# EAGLE design piHat_v1 (EAGLE 9.5.2)
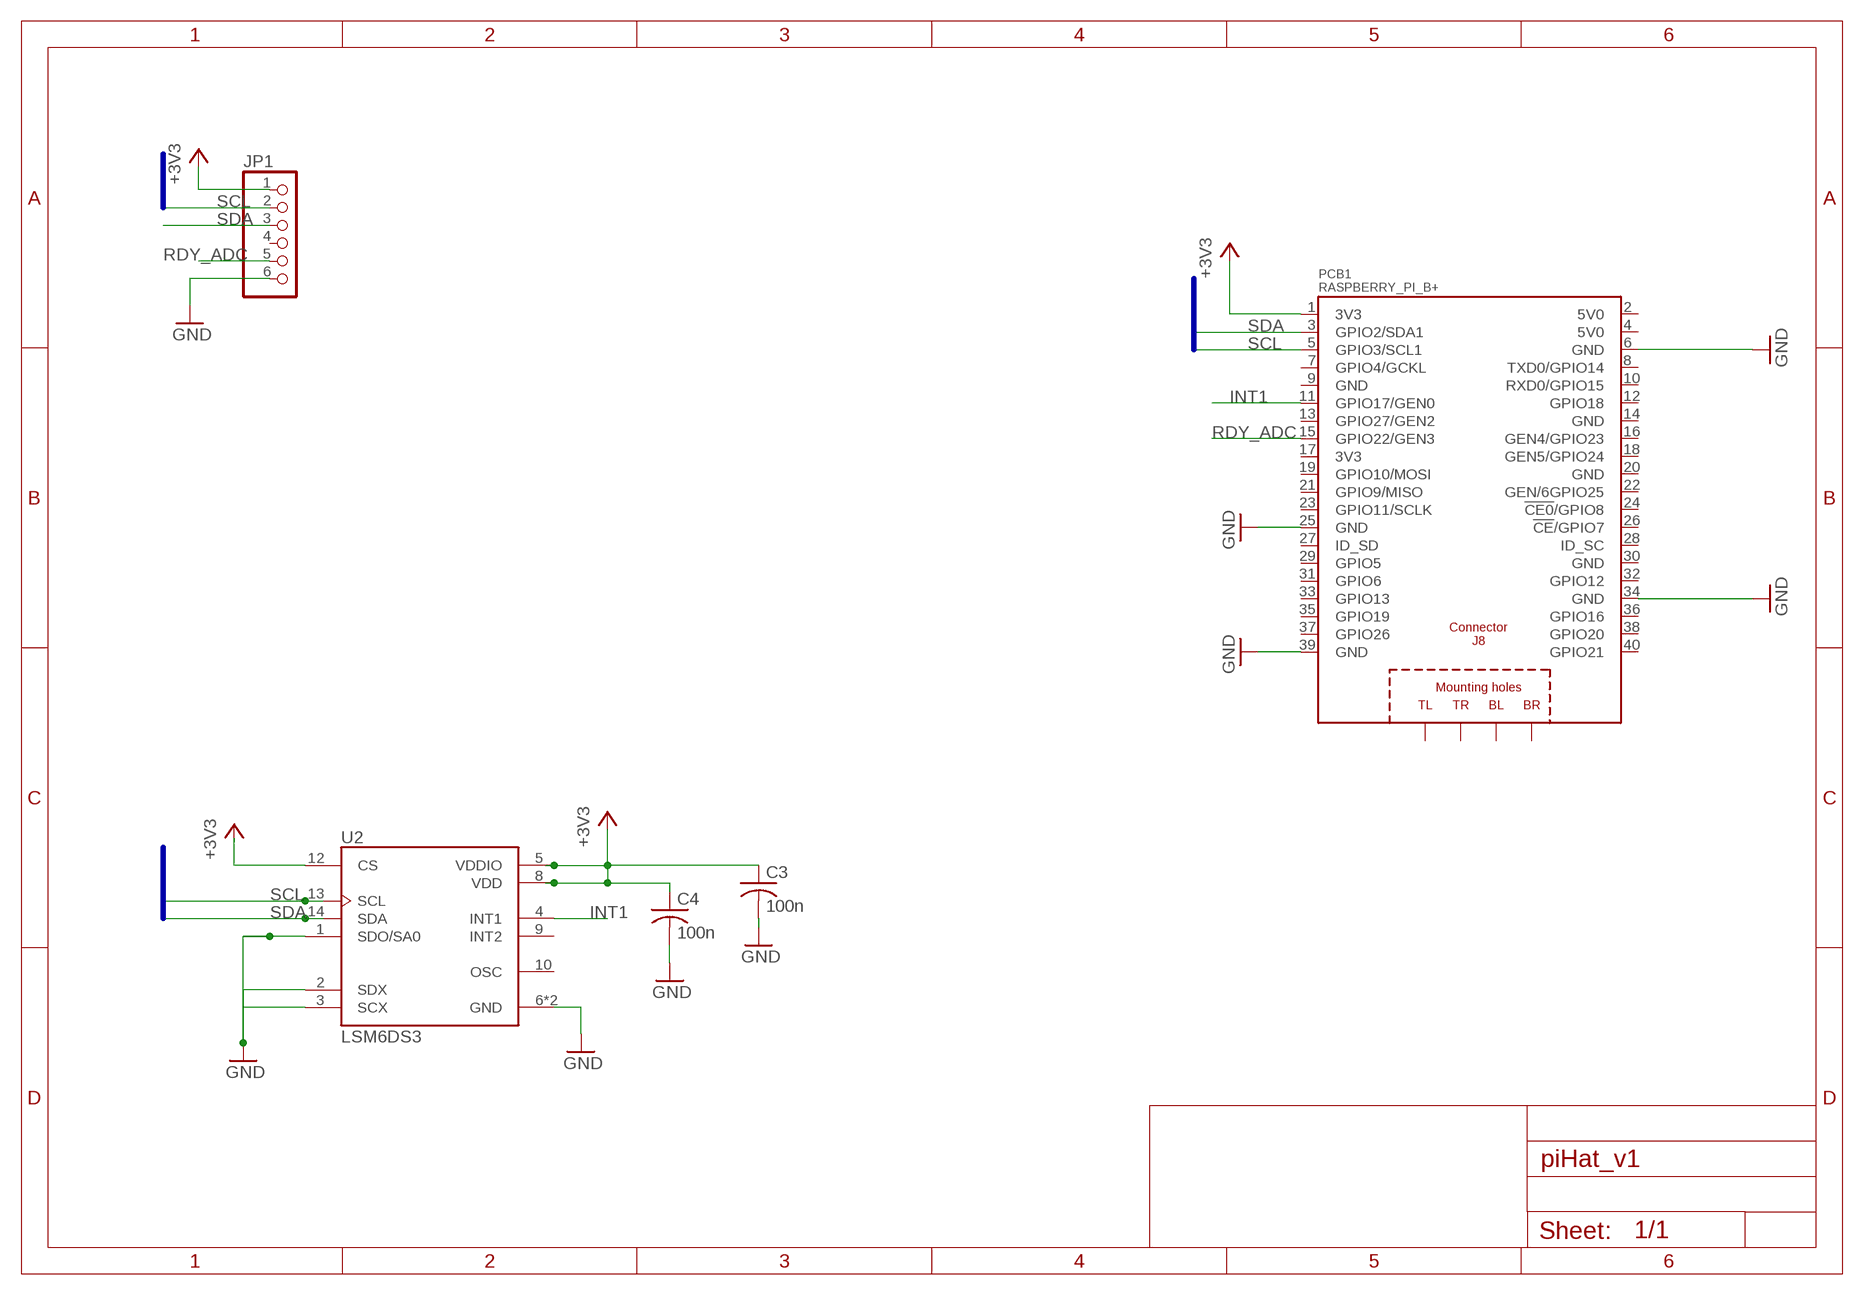
[diagram p0: schematic, sheet 1]

## Parts
C3  100n  C-USC1206  [C1206]
C4  100n  C-USC1206  [C1206]
JP1  PINHD-1X6  [1X06]
PCB1  RASPBERRY_PI_B+  [RASPBERRY_PI_B+]
U2  LSM6DS3  [PQFN50P300X250X86-14N]

## Nets
+3V3: C3.1 C4.1 JP1.1 PCB1.1(3V3) U2.5(VDDIO) U2.8(VDD) U2.12(CS)
GND: C3.2 C4.2 JP1.6 PCB1.6(GND) PCB1.25(GND) PCB1.39(GND) U2.1(SDO/SA0) U2.2(SDX) U2.3(SCX) U2.6(GND) U2.7(GND)
GND@7: PCB1.34(GND) ; supply symbol labelled GND
INT1: PCB1.11(GPIO17/GEN0) U2.4(INT1)
RDY_ADC: JP1.5 PCB1.15(GPIO22/GEN3)
SCL: JP1.2 PCB1.5(GPIO3/SCL1) U2.13(SCL)
SDA: JP1.3 PCB1.3(GPIO2/SDA1) U2.14(SDA)
Unconnected: JP1.4 PCB1.2(5V0) PCB1.4(5V0) PCB1.7(GPIO4/GCKL) PCB1.8(TXD0/GPIO14) PCB1.9(GND) PCB1.10(RXD0/GPIO15) PCB1.12(GPIO18) PCB1.13(GPIO27/GEN2) PCB1.14(GND) PCB1.16(GEN4/GPIO23) PCB1.17(3V3) PCB1.18(GEN5/GPIO24) PCB1.19(GPIO10/MOSI) PCB1.20(GND) PCB1.21(GPIO9/MISO) PCB1.22(GEN/6GPIO25) PCB1.23(GPIO11/SCLK) PCB1.24(!CE0!/GPIO8) PCB1.26(!CE!/GPIO7) PCB1.27(ID_SD) PCB1.28(ID_SC) PCB1.29(GPIO5) PCB1.30(GND) PCB1.31(GPIO6) PCB1.32(GPIO12) PCB1.33(GPIO13) PCB1.35(GPIO19) PCB1.36(GPIO16) PCB1.37(GPIO26) PCB1.38(GPIO20) PCB1.40(GPIO21) PCB1.PE_BL(BL) PCB1.PE_BR(BR) PCB1.PE_TL(TL) PCB1.PE_TR(TR) U2.9(INT2) U2.10(OSC)

## Buses
SCL,SDA
I2C:SCL,SDA

## Library data of the parts
C3 C4 = rcl:C-US: CAPACITOR, American symbol; SPICEPREFIX: C
JP1 = pinhead:PINHD-1X6: PIN HEADER
PCB1 = RASPBERRY_PI_B_:RASPBERRY_PI_B+: Raspberry Pi B+ Based on issue: Thursday, July 10, 2014 - Rev 1.2 LBR by Tim R. 07-2014; AVAILABILITY: Unavailable; DESCRIPTION: Case Plastic, ABS Black Hand Held, Split Sides 3.520 L x 2.740 W _89.41mm x 69.60mm_ X 0.980 _24.89mm_; MF: Raspberry Pi; MP: RASPBERRY PI B+; PACKAGE: None; PRICE: None
U2 = LSM6DS3:LSM6DS3: iNEMO inertial module: 3D accelerometer and 3D gyroscope; AVAILABILITY: Unavailable; DESCRIPTION: LSM6DS33 - Accelerometer, Gyroscope, 6 Axis Sensor Evaluation Board; MF: STMicroelectronics; MP: LSM6DS3; PACKAGE: LGA-14 STMicroelectronics; PRICE: None

## Board
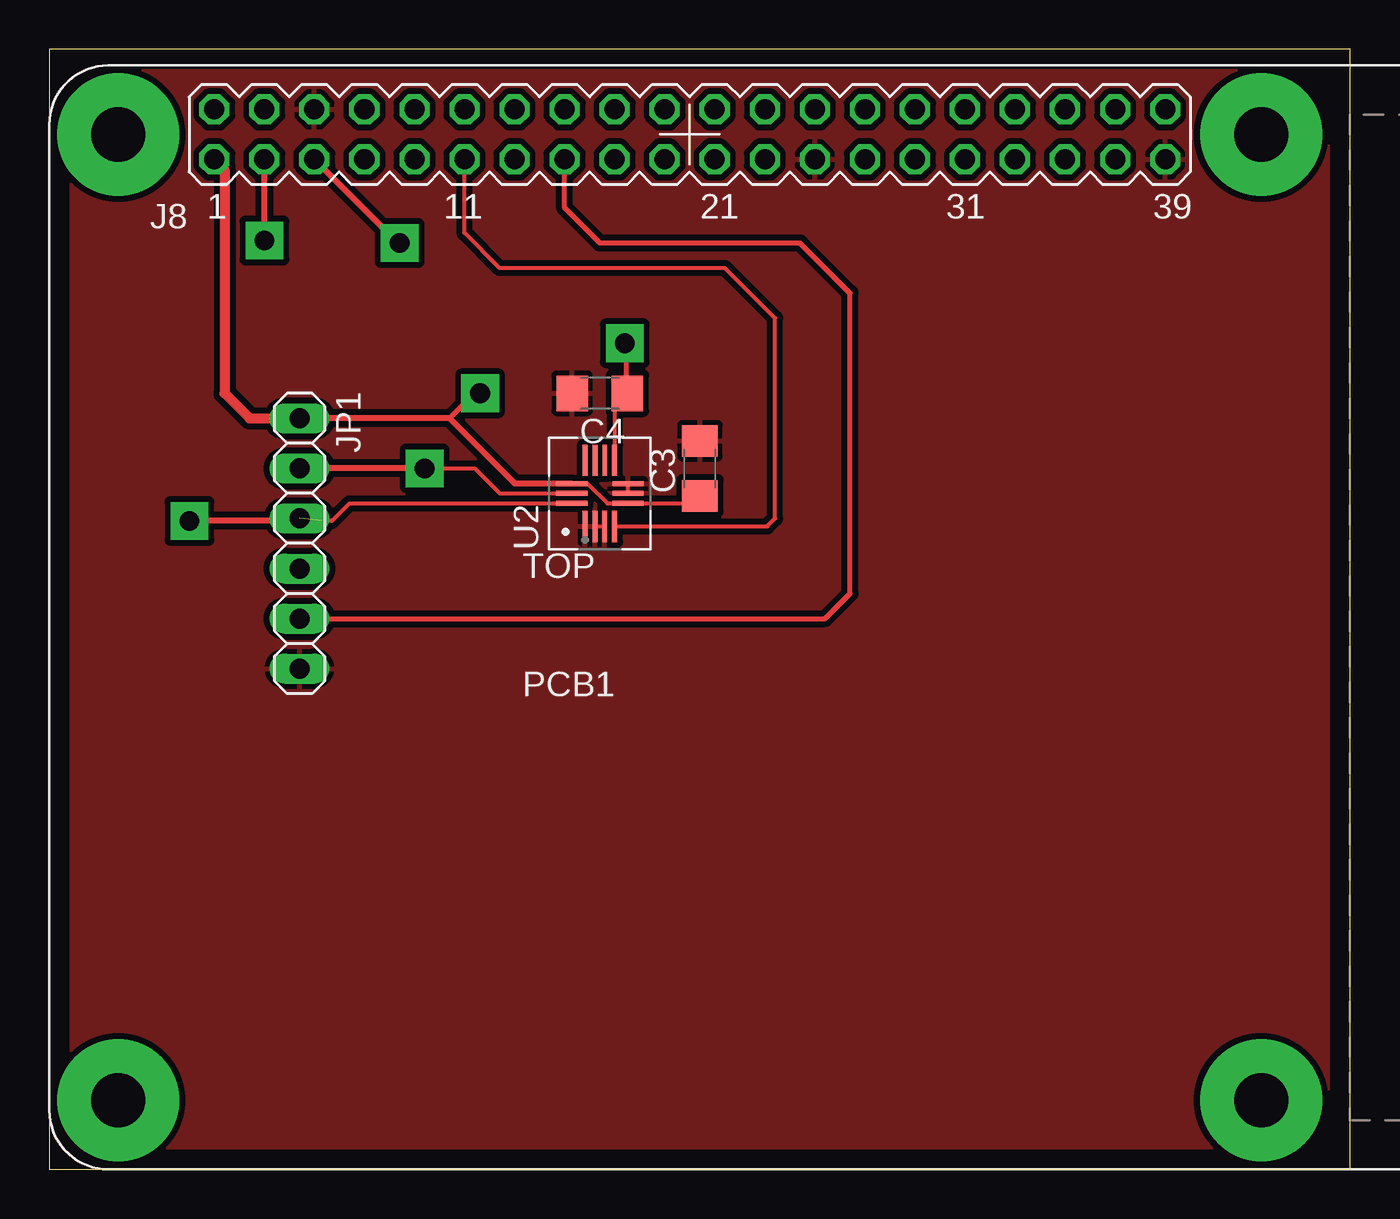
[diagram p1: board, top side]
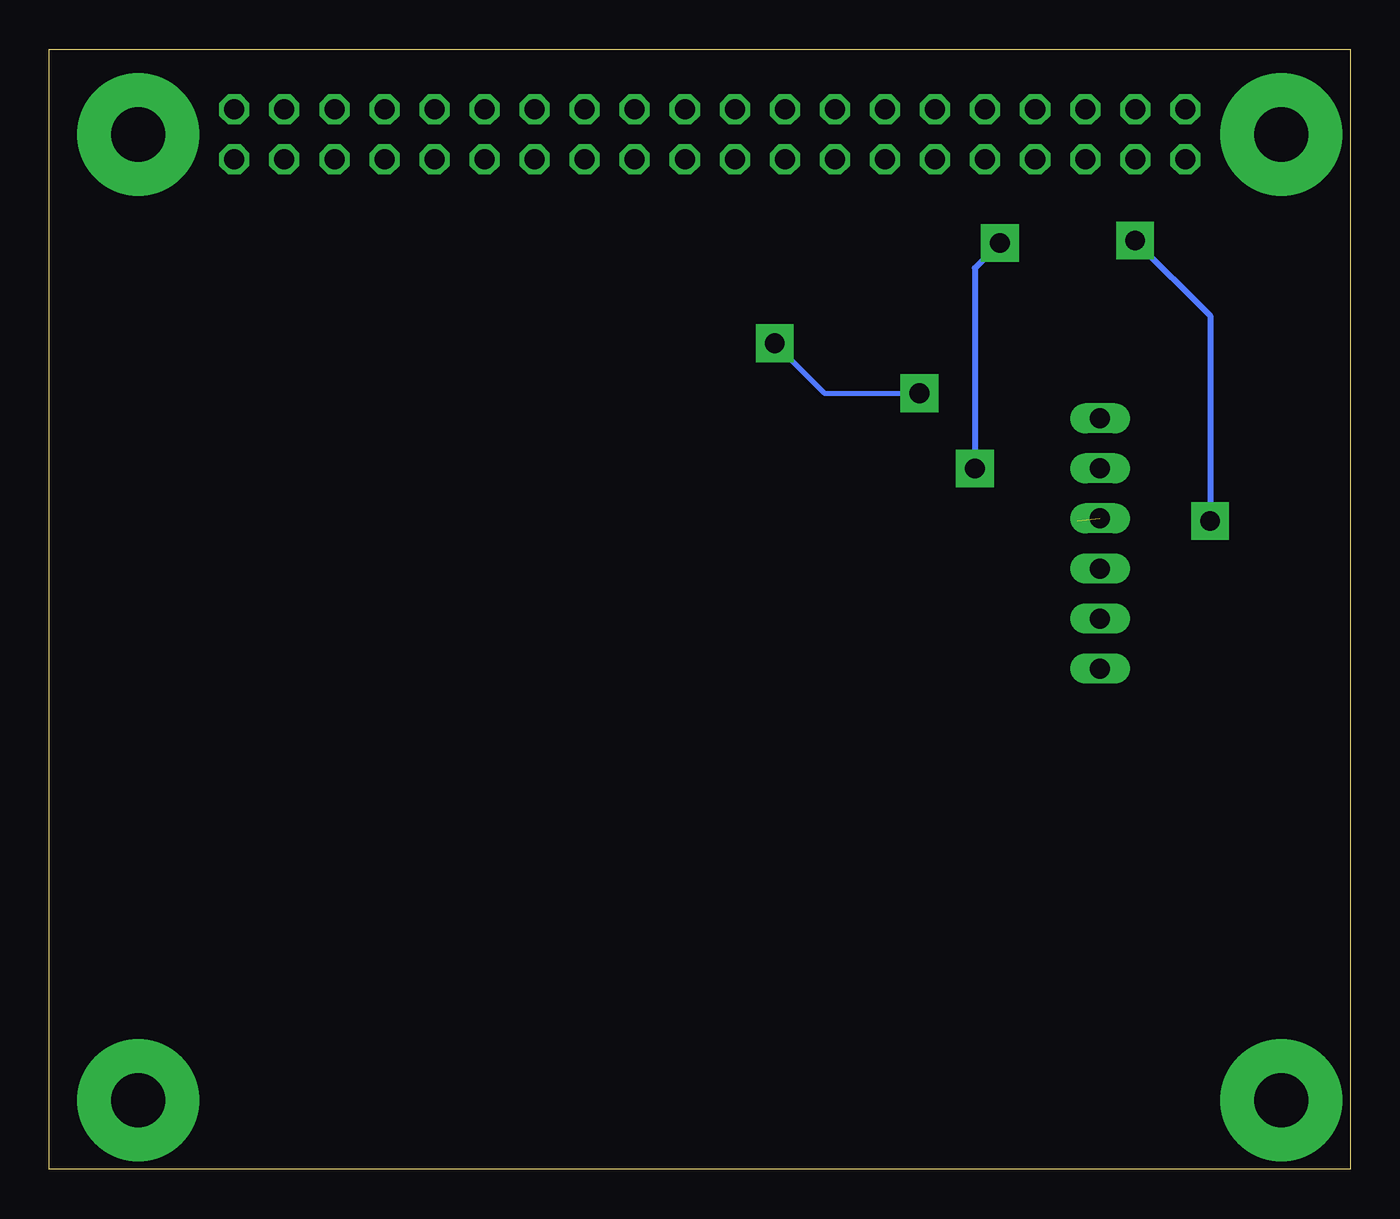
[diagram p2: board, bottom side, seen from below]

Size 66.02 x 56.82 mm. Coordinates in mm from the lower left corner, seen from the top.
Outline: 0,0 66.02,0 66.02,56.82 0,56.82 0,0
Copper layers (1*16): Top 0.035mm / dielectric 1.5mm / Bottom 0.035mm
Design rules "default *": minimum track width 6mil, minimum drill 0.35mm, track to track 12mil, track to pad 15mil, pad to pad 12mil, via to via 6mil, smd to smd 6mil, copper to edge 40mil, drill to drill 40mil, minimum pad ring 10mil, minimum via ring 18mil, stop-mask expansion 4mil, vias tented up to drill 0mil, thermal gap 10mil

### Footprints (pad centres in the part's own frame; a part is rotated, then mirrored left to right if it is on the bottom)
C1206 = smd 1.6 x 1.8: 1 -1.4,0; 2 1.4,0
1X06 = drill 1.016 long: 1 -6.35,0; 2 -3.81,0; 3 -1.27,0; 4 1.27,0; 5 3.81,0; 6 6.35,0
RASPBERRY_PI_B+ = drill 1.016 octagon: 1 8.37,51.23; 2 8.37,53.77; 3 10.91,51.23; 4 10.91,53.77; 5 13.45,51.23; 6 13.45,53.77; 7 15.99,51.23; 8 15.99,53.77; 9 18.53,51.23; 10 18.53,53.77; 11 21.07,51.23; 12 21.07,53.77; 13 23.61,51.23; 14 23.61,53.77; 15 26.15,51.23; 16 26.15,53.77; 17 28.69,51.23; 18 28.69,53.77; 19 31.23,51.23; 20 31.23,53.77; 21 33.77,51.23; 22 33.77,53.77; 23 36.31,51.23; 24 36.31,53.77; 25 38.85,51.23; 26 38.85,53.77; 27 41.39,51.23; 28 41.39,53.77; 29 43.93,51.23; 30 43.93,53.77; 31 46.47,51.23; 32 46.47,53.77; 33 49.01,51.23; 34 49.01,53.77; 35 51.55,51.23; 36 51.55,53.77; 37 54.09,51.23; 38 54.09,53.77; 39 56.63,51.23; 40 56.63,53.77 | drill 2.75 pad 6.2: PE_BL 3.5,3.5; PE_BR 61.5,3.5; PE_TL 3.5,52.5; PE_TR 61.5,52.5
PQFN50P300X250X86-14N = smd 1.58 x 0.25: 1 -1.675,0.75; 2 -1.675,0.25; 3 -1.675,-0.25; 4 -1.675,-0.75; 8 1.675,-0.75; 9 1.675,-0.25; 10 1.675,0.25; 11 1.675,0.75 | smd 0.25 x 1.58: 5 -0.5,-1.425; 6 0,-1.425; 7 0.5,-1.425; 12 0.5,1.425; 13 0,1.425; 14 -0.5,1.425

### Placement (x,y rotation side)
C3  33.02,35.56 90 top
C4  27.94,39.37 180 top
JP1  12.7,31.75 270 top
PCB1  0,0 0 top
U2  27.94,34.29 90 top

### Tracks (layer width: path | path; a pad name or v marks a point on that pad's centre or on a via)
+3V3  (via drill 1)
  Top 0.203: C3.1 32.65,33.79 U2.5 29.36,33.78 28.32,33.78 27.31,34.79 U2.12 | C4.1 29.27,39.3 28.69,38.72 U2.8
  Top 0.254: v29.21,41.91 29.27,41.84 29.27,39.3 | 20.32,38.1 21.59,39.37 v21.87,39.37
  Top 0.305: JP1.1 20.32,38.1 23.63,34.79 U2.12
  Top 0.508: PCB1.1 8.89,50.71 8.89,39.37 10.16,38.1 JP1.1
  Bottom 0.254: v29.21,41.91 26.67,39.37 v21.87,39.37
GND
  Top 0.152: U2.2 27.73,32.62 U2.2 | U2.2 U2.3 | U2.6 U2.7
  pour Top: 0,57.15 67.31,57.15 67.31,-1.27 66.04,-2.54 64.77,-3.81 -1.27,-3.81 -1.27,55.88
INT1
  Top 0.203: U2.4 36.42,32.62 36.83,33.02 36.83,43.18 34.29,45.72 22.86,45.72 21.07,47.51 PCB1.11
RDY_ADC
  Top 0.254: JP1.5 39.37,27.94 40.64,29.21 40.64,44.45 38.1,46.99 27.94,46.99 26.15,48.78 PCB1.15
SCL  (via drill 1)
  Top 0.203: 17.69,46.99 v17.78,46.99 | v19.05,35.56 21.59,35.56 22.86,34.29 U2.13
  Top 0.305: PCB1.5 17.69,46.99 | v19.05,35.56 JP1.2
  Bottom 0.305: v17.78,46.99 19.05,45.72 v19.05,35.56
SDA  (via drill 1)  (1 unrouted)
  Top 0.203: v10.91,47.13 v10.92,47.12 | U2.14 15.24,33.79 14.34,32.89 12.7,32.89
  Top 0.305: PCB1.3 v10.91,47.13 | 13.84,32.89 12.7,32.89 v7.11,32.89
  Bottom 0.305: v10.92,47.12 7.11,43.31 v7.11,32.89